# Altium schematic sheet introduction.SchDoc: Introduction
size A4; Date: 2022-01-17; Author: Juan del Pino Mena; CompanyName: TCI; DrawnBy: Juan del Pino Mena; Engineer: Juan del Pino Mena; Organization: UGR; Revision: 0.8; SheetNumber: 1; SheetTotal: 3
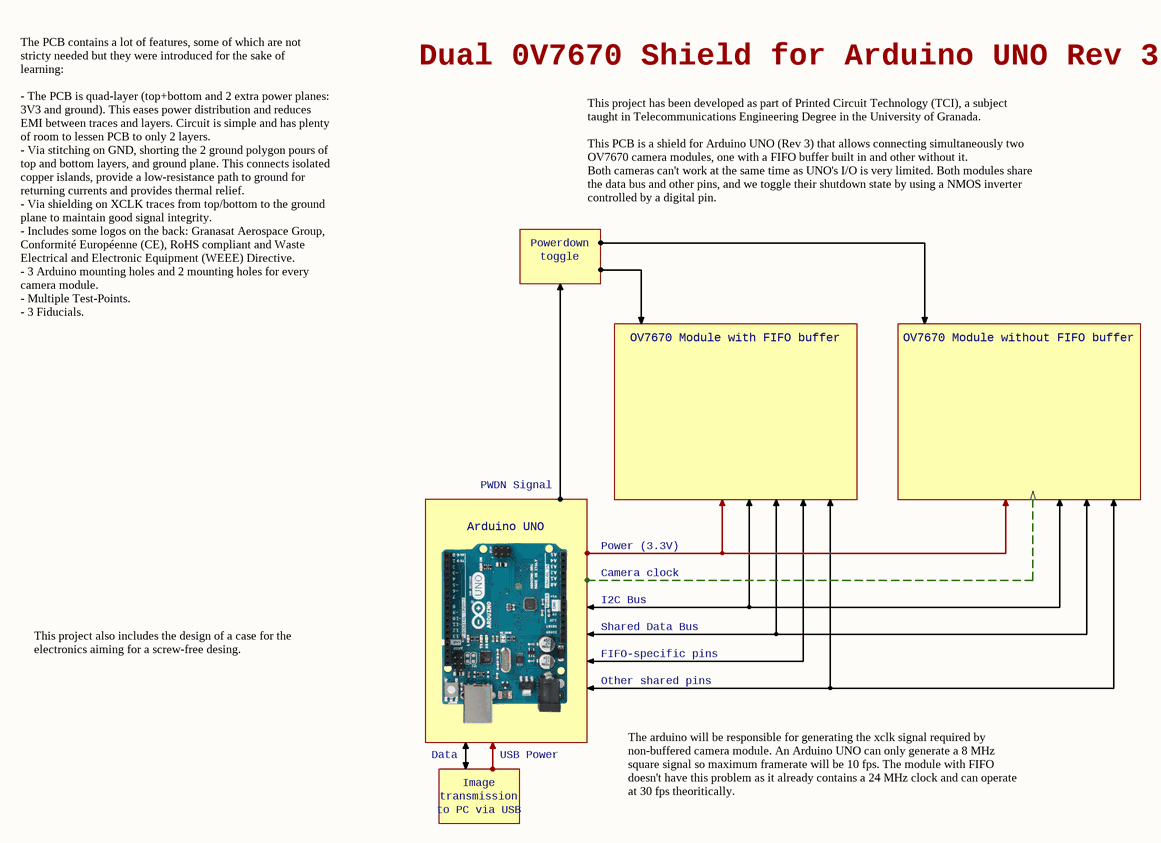
[diagram p0: introduction.SchDoc]

## Notes on the sheet
- Dual 0V7670 Shield for Arduino UNO Rev 3
- This project has been developed as part of Printed Circuit Technology (TCI), a subject taught in Telecommunications Engineering Degree in the University of Granada.
  This PCB is a shield for Arduino UNO (Rev 3) that allows connecting simultaneously two OV7670 camera modules, one with a FIFO buffer built in and other without it.
  Both cameras can't work at the same time as UNO's I/O is very limited. Both modules share the data bus and other pins, and we toggle their shutdown state by using a NMOS inverter controlled by a digital pin.
- Powerdown
- toggle
- The PCB contains a lot of features, some of which are not stricty needed but they were introduced for the sake of learning:
  - The PCB is quad-layer (top+bottom and 2 extra power planes: 3V3 and ground). This eases power distribution and reduces EMI between traces and layers. Circuit is simple and has plenty of room to lessen PCB to only 2 layers.
  - Via stitching on GND, shorting the 2 ground polygon pours of top and bottom layers, and ground plane. This connects isolated copper islands, provide a low-resistance path to ground for returning currents and provides thermal relief.
  - Via shielding on XCLK traces from top/bottom to the ground plane to maintain good signal integrity.
  - Includes some logos on the back: Granasat Aerospace Group, Conformité Européenne (CE), RoHS compliant and Waste Electrical and Electronic Equipment (WEEE) Directive.
  - 3 Arduino mounting holes and 2 mounting holes for every camera module.
  - Multiple Test-Points.
  - 3 Fiducials.
- OV7670 Module with FIFO buffer
- OV7670 Module without FIFO buffer
- PWDN Signal
- Arduino UNO
- Power (3.3V)
- I2C Bus
- Camera clock
- This project also includes the design of a case for the electronics aiming for a screw-free desing.
- Shared Data Bus
- FIFO-specific pins
- Other shared pins
- Data
- USB Power
- to PC via USB
- transmission
- Image
- The arduino will be responsible for generating the xclk signal required by non-buffered camera module. An Arduino UNO can only generate a 8 MHz square signal so maximum framerate will be 10 fps. The module with FIFO doesn't have this problem as it already contains a 24 MHz clock and can operate at 30 fps theoritically.
- Designer's signature
- Sheet title:
- Dpto. Electrónica y Tecnología
- de Computadores
- Supervisor's signature
- Project title:
- Desginer:
- University of Granada
- C/ Fuente Nueva, s/n, 18001
- Granada, Granada, Spain
- Sr. Andrés Roldán Aranda
- Date:
- Revision:
- Sheet
- of